# EasyEDA schematic schematic.json
TITLE: Sheet_1; REV: 1.0; Date: 2024-08-21; Sheet: 1/1; Drawn By: eminentquasar34; Company: Your Company
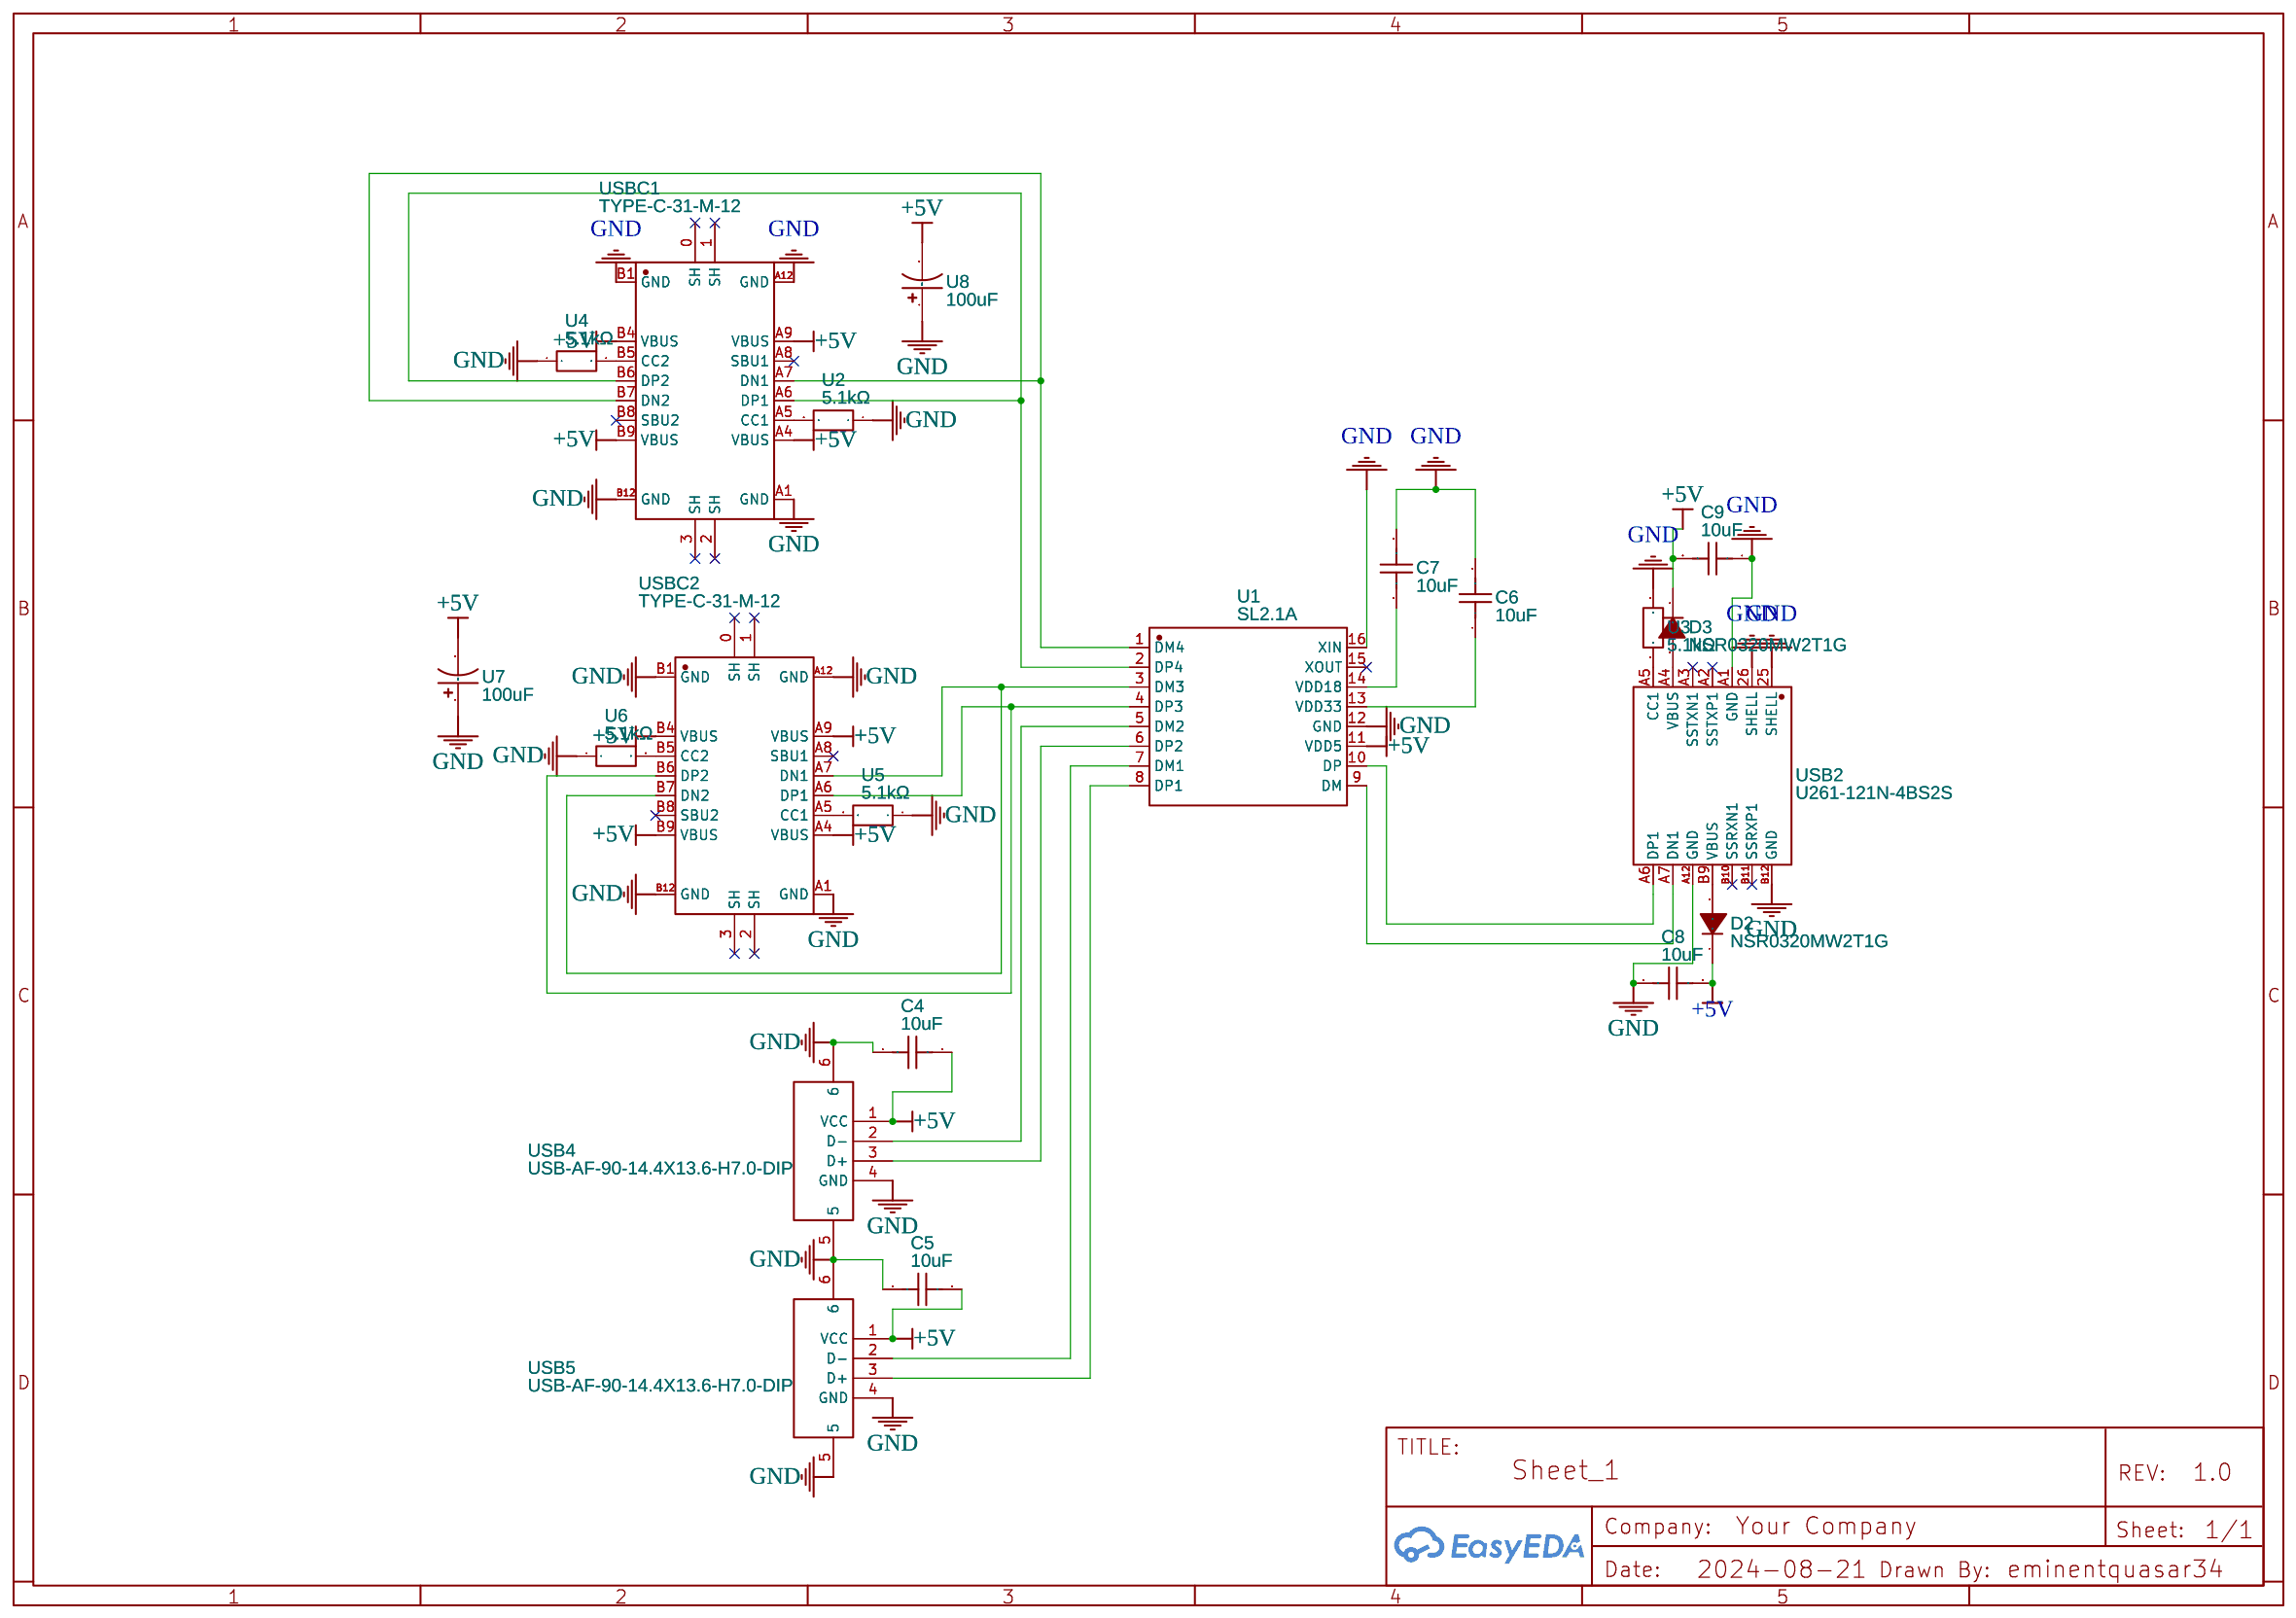
[diagram p0: schematic sheet]

## Parts
C4  10uF  [C0603]
C5  10uF  [C0603]
C6  10uF  [C0603]
C7  10uF  [C0603]
C8  10uF  [C0603]
C9  10uF  [C0603]
D2  NSR0320MW2T1G  [SOD-323_L1.8-W1.3-LS2.5-RD]
D3  NSR0320MW2T1G  [SOD-323_L1.8-W1.3-LS2.5-RD]
U1  SL2.1A  [SOP-16_L10.0-W3.9-P1.27-LS6.0-BL]
U2  5.1kΩ  [RES-TH_BD2.7-L6.2-P10.20-D0.4]
U3  5.1kΩ  [RES-TH_BD2.7-L6.2-P10.20-D0.4]
U4  5.1kΩ  [RES-TH_BD2.7-L6.2-P10.20-D0.4]
U5  5.1kΩ  [RES-TH_BD2.7-L6.2-P10.20-D0.4]
U6  5.1kΩ  [RES-TH_BD2.7-L6.2-P10.20-D0.4]
U7  100uF  [CAP-TH_BD6.3-P2.50-D1.0-FD]
U8  100uF  [CAP-TH_BD6.3-P2.50-D1.0-FD]
USB2  U261-121N-4BS2S  [USB-C-SMD_U261-121N-4BS2S]
USB4  USB-AF-90-14.4X13.6-H7.0-DIP  [USB-A-TH_C46407]
USB5  USB-AF-90-14.4X13.6-H7.0-DIP  [USB-A-TH_C46407]
USBC1  TYPE-C-31-M-12  [USB-C_SMD-TYPE-C-31-M-12]
USBC2  TYPE-C-31-M-12  [USB-C_SMD-TYPE-C-31-M-12]

## Library data of the parts
C4-C9 = CL10A106KP8NNNC: Supplier: LCSC; Manufacturer: SAMSUNG(三星); Supplier Part: C19702; JLCPCB Part Class: Basic Part
D2 D3 = NSR0320MW2T1G: Supplier: LCSC; Manufacturer: onsemi(安森美); Supplier Part: C48192; JLCPCB Part Class: Extended Part
U1 = SL2.1A: Contributor: LCSC; Supplier: LCSC; Supplier Part: C192893; Manufacturer: CoreChips(和芯润德); JLCPCB Part Class: Extended Part
U2-U6 = CR1/4W-5K1±5%-ST26: Contributor: lcsc; Supplier: LCSC; Supplier Part: C2896864; Manufacturer: VO(翔胜); JLCPCB Part Class: Extended Part
U7 U8 = 16YXF100MEFC6.3X11: Contributor: lcsc; Supplier: LCSC; Supplier Part: C338173; Manufacturer: rubycon(红宝石); JLCPCB Part Class: Extended Part
USB2 = U261-121N-4BS2S: Contributor: LCSC; Supplier: LCSC; Supplier Part: C2879827; Manufacturer: XKB Connectivity(中国星坤); JLCPCB Part Class: Extended Part
USB4 USB5 = USB-AF-90-14.4X13.6-H7.0-DIP: Contributor: LCSC; Supplier: LCSC; Supplier Part: C46407; Manufacturer: 精拓金; Manufacturer Part: 903-131A1011D10100; JLCPCB Part Class: Extended Part
USBC1 USBC2 = TYPE-C-31-M-12: Contributor: LCSC; Supplier: LCSC; Supplier Part: C165948; Manufacturer: 韩国韩荣; JLCPCB Part Class: Extended Part

## Nets
+5V: C4.2 C5.2 C8.2 C9.2 D2.1(C) D3.1(C) U1.11(VDD5) U7.2 U8.2 USB4.1(VCC) USB5.1(VCC) USBC1.A4(VBUS) USBC1.A9(VBUS) USBC1.B4(VBUS) USBC1.B9(VBUS) USBC2.A4(VBUS) USBC2.A9(VBUS) USBC2.B4(VBUS) USBC2.B9(VBUS)
GND: C4.1 C5.1 C6.2 C7.2 C8.1 C9.1 U1.12(GND) U1.16(XIN) U2.1 U3.2 U4.1 U5.1 U6.1 U7.1 U8.1 USB2.25(SHELL) USB2.26(SHELL) USB2.A1(GND) USB2.A12(GND) USB2.B12(GND) USB4.4(GND) USB4.5 USB4.6 USB5.4(GND) USB5.5 USB5.6 USBC1.A1(GND) USBC1.A12(GND) USBC1.B1(GND) USBC1.B12(GND) USBC2.A1(GND) USBC2.A12(GND) USBC2.B1(GND) USBC2.B12(GND)
Net-(C6-1): C6.1 U1.13(VDD33)
Net-(C7-1): C7.1 U1.14(VDD18)
Net-(D2-2): D2.2(A) USB2.B9(VBUS)
Net-(D3-2): D3.2(A) USB2.A4(VBUS)
Net-(U1-1): U1.1(DM4) USBC1.A7(DN1) USBC1.B7(DN2)
Net-(U1-2): U1.2(DP4) USBC1.A6(DP1) USBC1.B6(DP2)
Net-(U1-3): U1.3(DM3) USBC2.A7(DN1) USBC2.B7(DN2)
Net-(U1-4): U1.4(DP3) USBC2.A6(DP1) USBC2.B6(DP2)
Net-(U1-5): U1.5(DM2) USB4.2(D-)
Net-(U1-6): U1.6(DP2) USB4.3(D+)
Net-(U1-7): U1.7(DM1) USB5.2(D-)
Net-(U1-8): U1.8(DP1) USB5.3(D+)
Net-(U1-9): U1.9(DM) USB2.A7(DN1)
Net-(U1-10): U1.10(DP) USB2.A6(DP1)
Net-(U2-2): U2.2 USBC1.A5(CC1)
Net-(U3-1): U3.1 USB2.A5(CC1)
Net-(U4-2): U4.2 USBC1.B5(CC2)
Net-(U5-2): U5.2 USBC2.A5(CC1)
Net-(U6-2): U6.2 USBC2.B5(CC2)

Not connected (* = marked no-connect by the designer): U1 15(XOUT)*; USB2 A2(SSTXP1)* A3(SSTXN1)* B10(SSRXN1)* B11(SSRXP1)*; USBC1 0(SH)* 1(SH)* 2(SH)* 3(SH)* A8(SBU1)* B8(SBU2)*; USBC2 0(SH)* 1(SH)* 2(SH)* 3(SH)* A8(SBU1)* B8(SBU2)*
